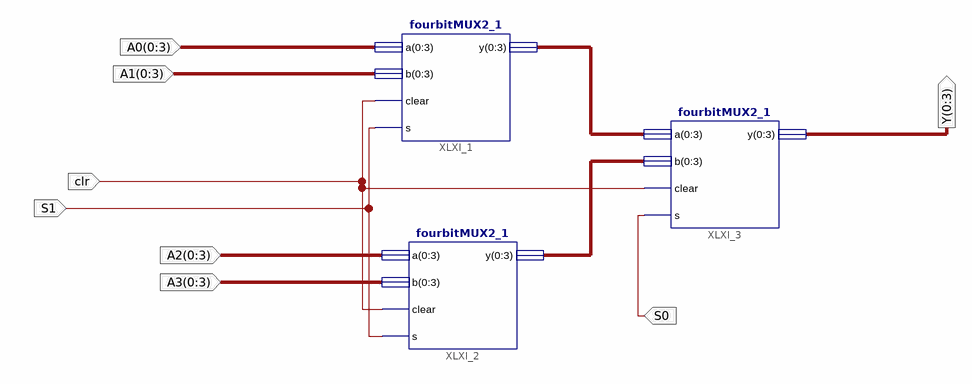
[diagram p0: schematic sheet 1]
// Xilinx ISE schematic Mux4bit4_1.sch (artix7) as structural Verilog: 3 symbols, 8 ports
module Mux4bit4_1 (
  input  [0:3] A0,
  input  [0:3] A1,
  input  [0:3] A2,
  input  [0:3] A3,
  input  clr,
  input  S1,
  input  S0,
  output [0:3] Y
);

  wire [3:0] XLXN_1, XLXN_2;

  fourbitMUX2_1 XLXI_1 (.a(A0), .b(A1), .clear(clr), .s(S1), .y({XLXN_1[0], XLXN_1[1], XLXN_1[2], XLXN_1[3]}));
  fourbitMUX2_1 XLXI_2 (.a(A2), .b(A3), .clear(clr), .s(S1), .y({XLXN_2[0], XLXN_2[1], XLXN_2[2], XLXN_2[3]}));
  fourbitMUX2_1 XLXI_3 (
    .a({XLXN_1[0], XLXN_1[1], XLXN_1[2], XLXN_1[3]}), .b({XLXN_2[0], XLXN_2[1], XLXN_2[2], XLXN_2[3]}),
    .clear(clr), .s(S0), .y(Y));
endmodule
